# Altium project manta_flightcontroller.PrjPcb
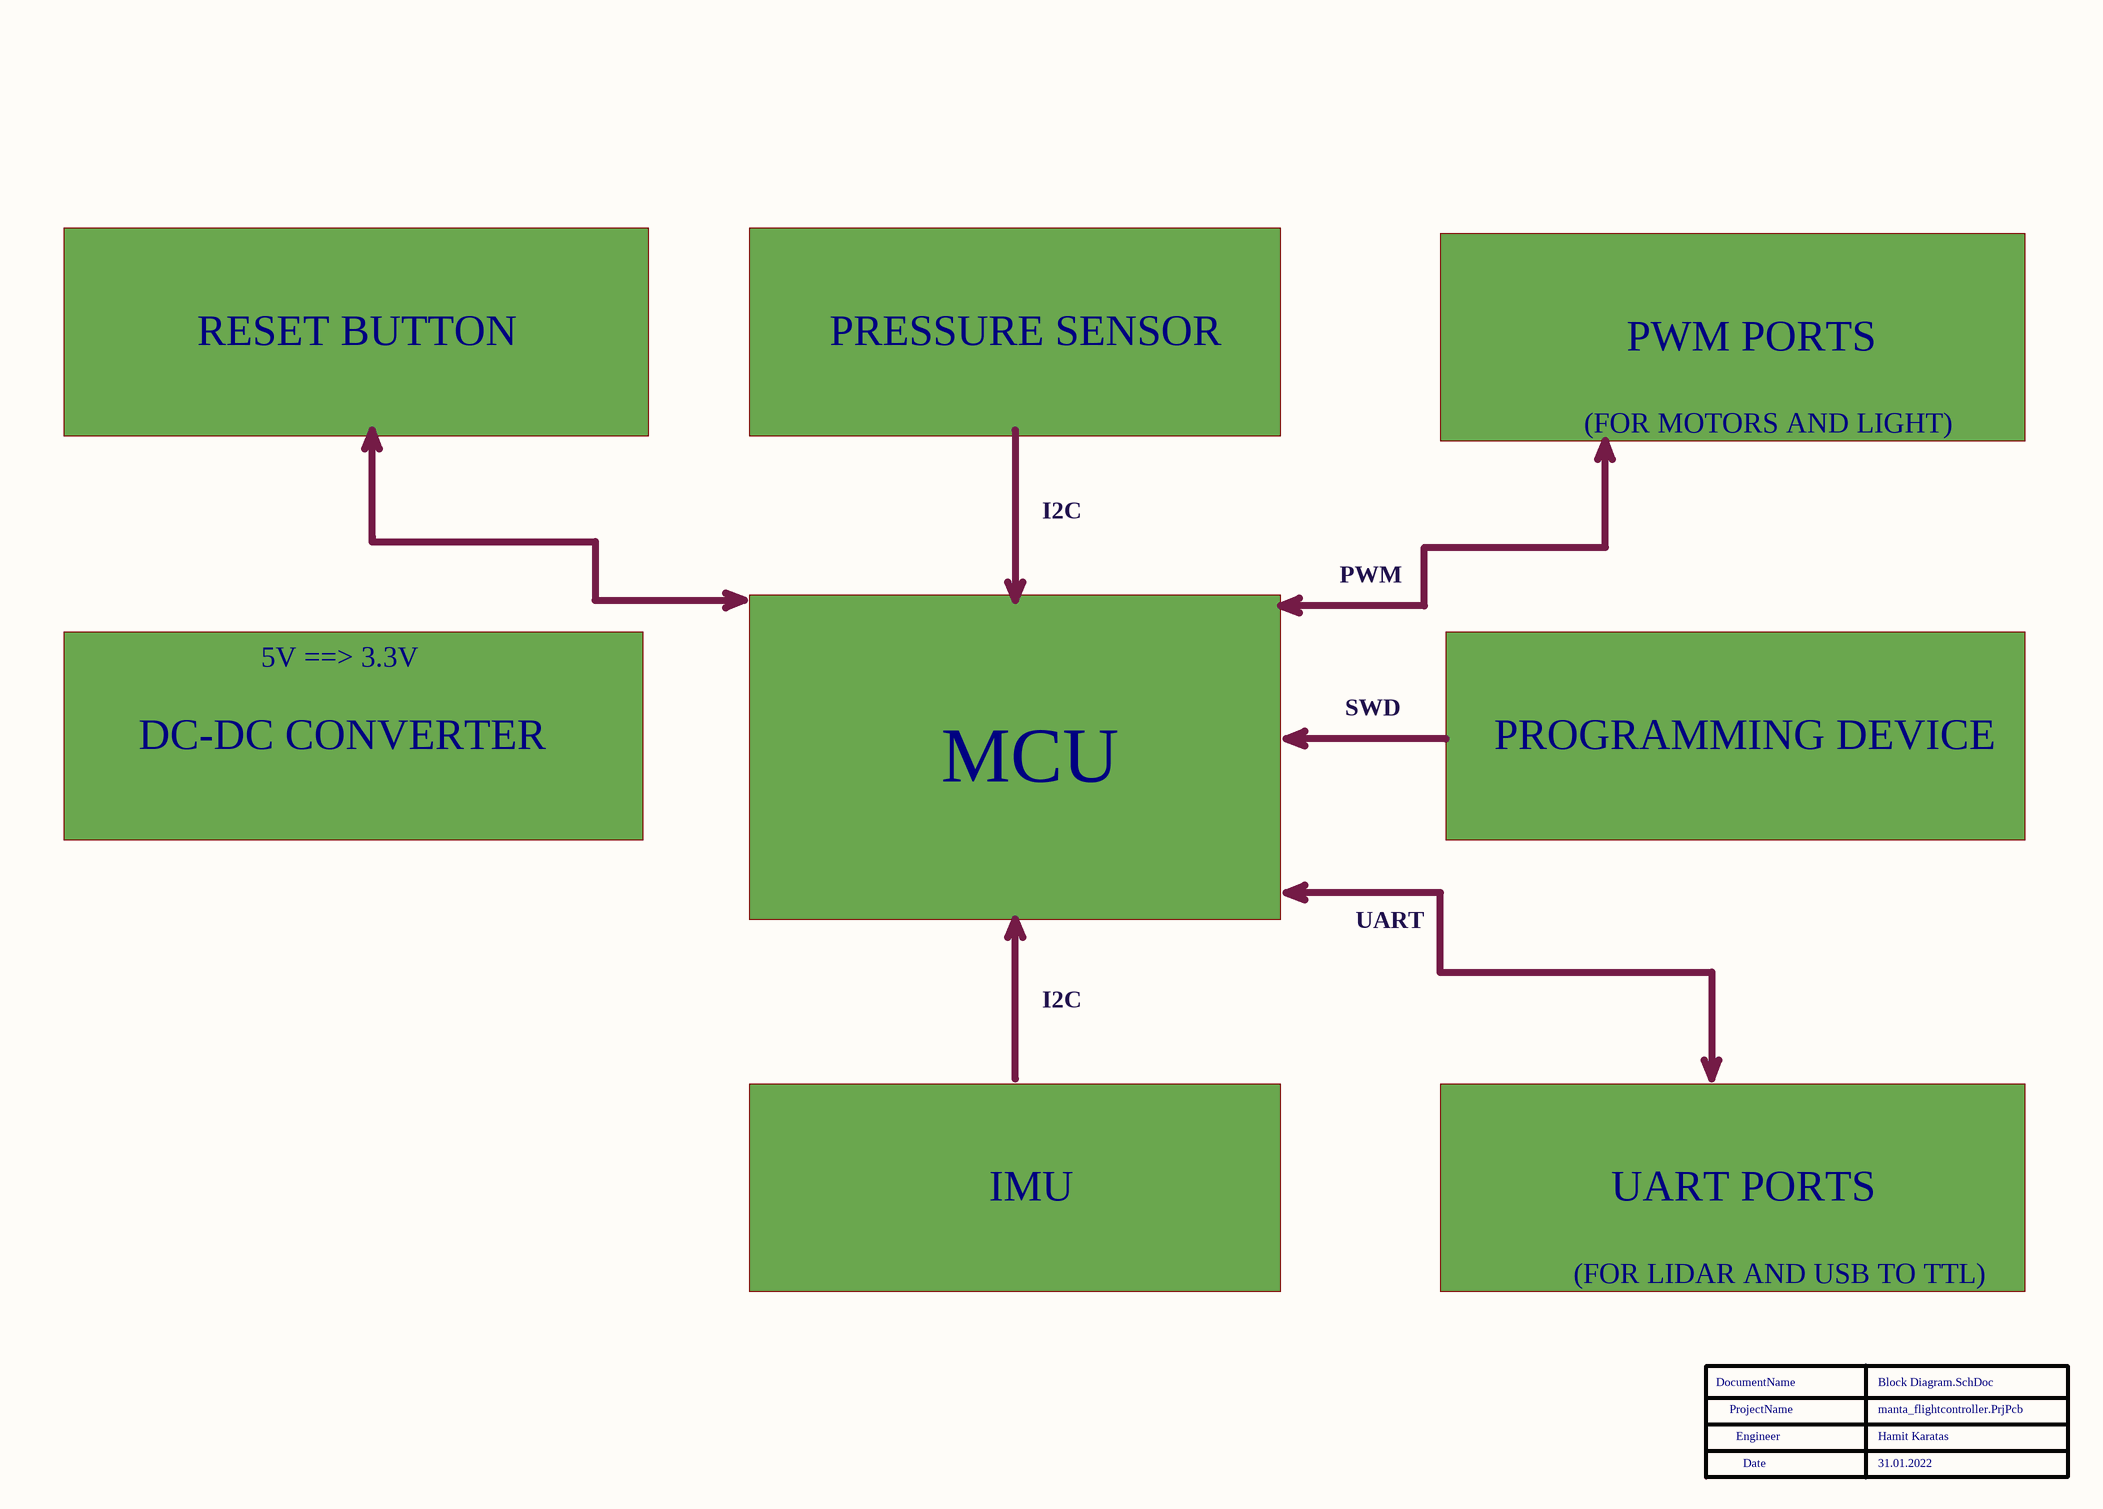
[diagram p0: Block Diagram.SchDoc]
2 sheets, 58 parts. Net scope: global (net labels, ports and power ports of the same name join across sheets).
Board file: PCB1.PcbDoc
Sheets:
  Block Diagram.SchDoc
  Sheet1.SchDoc

## Sheet Block Diagram.SchDoc
size A3; Engineer: Hamit Karatas; SheetNumber: 1; SheetTotal: 2

### Notes on the sheet
- RESET BUTTON
- PRESSURE SENSOR
- PWM PORTS
- (FOR MOTORS AND LIGHT)
- I2C
- PWM
- 5V ==> 3.3V
- SWD
- DC-DC CONVERTER
- PROGRAMMING DEVICE
- MCU
- UART
- IMU
- UART PORTS
- (FOR LIDAR AND USB TO TTL)
- DocumentName
- ProjectName
- Engineer
- Date
- 31.01.2022
- THIS DOCUMENT AND THE DATA DISCLOSED HEREIN OR
- HEREWITH IS THE PROPERTY OF ALTIUM LIMITED AND MAY
- DWG NO:
- REVISION
- REV:
- DESCRIPTION
- DATE
- APPROVED
- BE FREELY DISTRIBUTED IN WHOLE. NO RIGHTS ARE
- RESERVED OR EXPRESS OR IMPLIED WARANTEE GIVEN.
- ENG:
- APPROVALS
- PROJECT
- DSN:
- CHK:
- REFERENCE DOCUMENTS
- PROJECT REVISION:
- TITLE
- DOCUMENT REVISION:
- DESIGN ITEM:
- BOM:
- FAB DWG:
- PCB DWG:
- ASSY DWG:
- SCALE:
- A3
- SIZE
- CAGE CODE
- FILE NAME
- DWG NO.
- SHEET
- OF
- REV
- 31.01.2000

## Sheet Sheet1.SchDoc
size A3; Engineer: Hamit Karatas; SheetNumber: 2; SheetTotal: 2
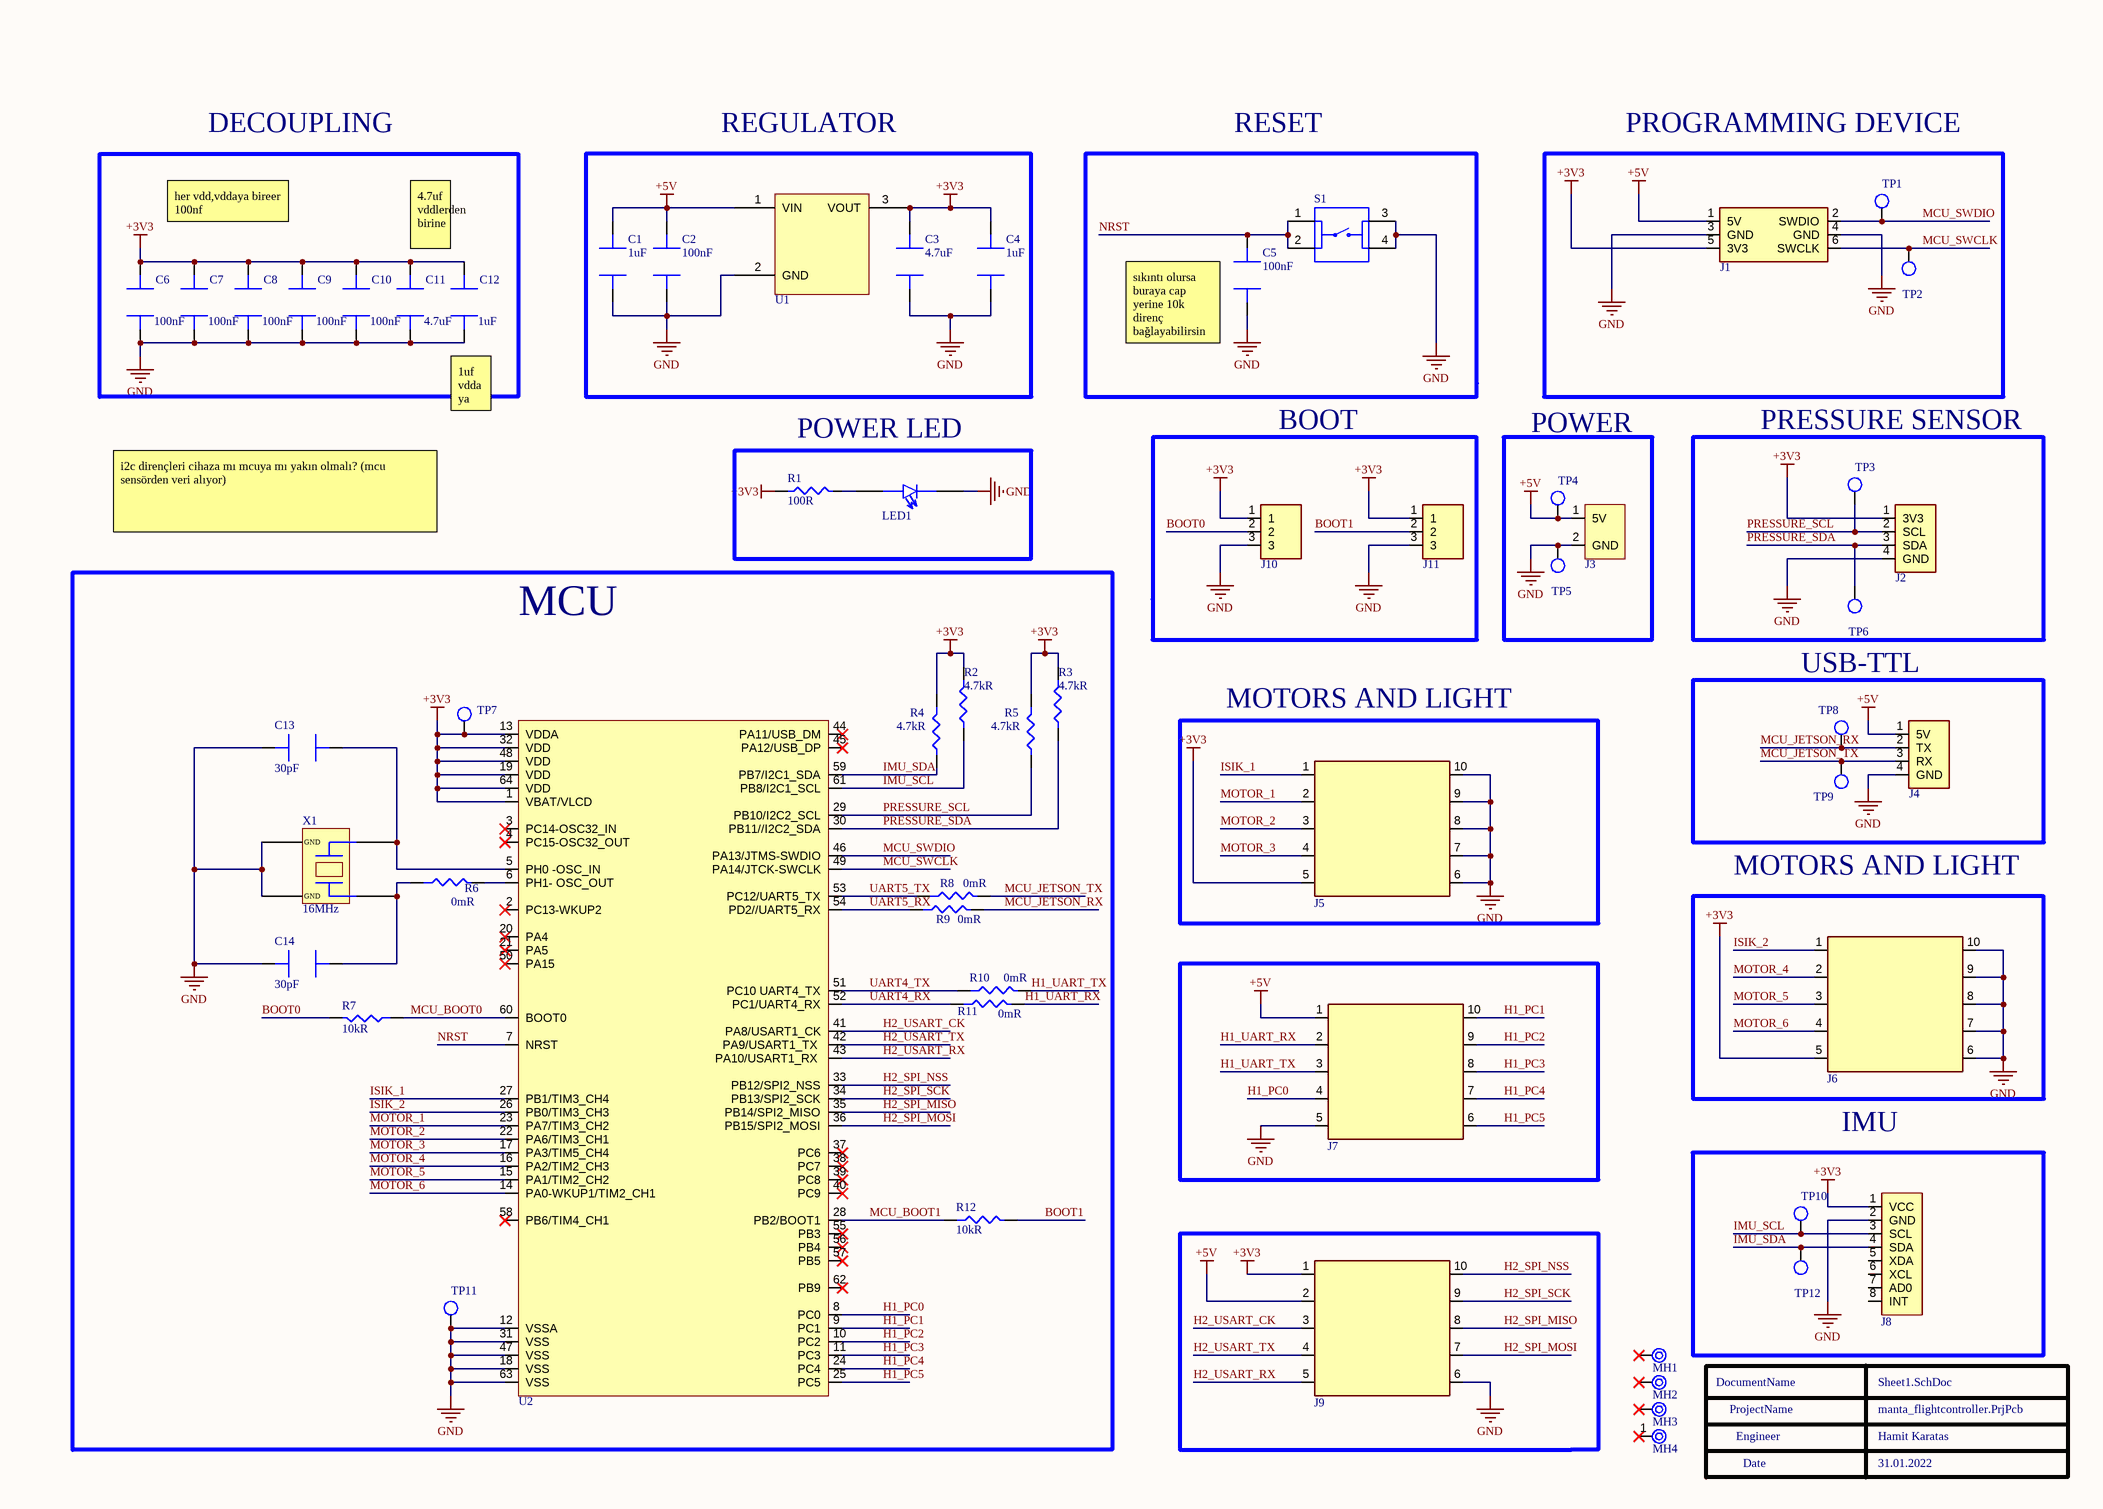
[diagram p1: Sheet1.SchDoc]

### Parts
C1  Capacitance: 1uF  [cap_0805]  (hidden comment: CAP CER 1uF 0805)
C2  Capacitance: 100nF  [cap_0805]  (hidden comment: CL21B104KBCNNNC)
C3  Capacitance: 4.7uF  [cap_0805]  (hidden comment: CL21A475KAQNNNE)
C4  Capacitance: 1uF  [cap_0805]  (hidden comment: CAP CER 1uF 0805)
C5  Capacitance: 100nF  [CAP_0603]  (hidden comment: CAP CER 100nF 0603)
C6  Capacitance: 100nF  [CAP_0603]  (hidden comment: CAP CER 100nF 0603)
C7  Capacitance: 100nF  [CAP_0603]  (hidden comment: CAP CER 100nF 0603)
C8  Capacitance: 100nF  [CAP_0603]  (hidden comment: CAP CER 100nF 0603)
C9  Capacitance: 100nF  [CAP_0603]  (hidden comment: CAP CER 100nF 0603)
C10  Capacitance: 100nF  [CAP_0603]  (hidden comment: CAP CER 100nF 0603)
C11  Capacitance: 4.7uF  [cap_0805]  (hidden comment: CL21A475KAQNNNE)
C12  Capacitance: 1uF  [cap_0805]  (hidden comment: CAP CER 1uF 0805)
C13  Capacitance: 30pF  [cap_0805]  (hidden comment: C0805C300M5HAC7800)
C14  Capacitance: 30pF  [cap_0805]  (hidden comment: C0805C300M5HAC7800)
J1  67997-206HLF  [CONN 6 PINS 2 ROWS]  (value not drawn)
J2  61300411121  [CONN 4PINS 1 ROW]  (value not drawn)
J3  TERMINAL BLOCK, PLUGGABLE, 5.08,  [TBP01R1-508-02BE]  (value not drawn)
J4  61300411121  [CONN 4PINS 1 ROW]  (value not drawn)
J5  302-S101  [CONN 10 PINS 2 ROWS]  (value not drawn)
J6  302-S101  [CONN 10 PINS 2 ROWS]  (value not drawn)
J7  302-S101  [CONN 10 PINS 2 ROWS]  (value not drawn)
J8  CONN 8 PIN  [CONN 8 PINS TH 2.54mm]  (value not drawn)
J9  302-S101  [CONN 10 PINS 2 ROWS]  (value not drawn)
J10  Conn Header HDR 3 POS 2.54mm  [CONN 3 PINS]  (value not drawn)
J11  Conn Header HDR 3 POS 2.54mm  [CONN 3 PINS]  (value not drawn)
LED1  LTST-C171GKT  [LED GREEN 0805]  (value not drawn)
MH1  MOUNTING HOLE  [MOUNTING HOLE]  (value not drawn)  (no BOM)
MH2  MOUNTING HOLE  [MOUNTING HOLE]  (value not drawn)  (no BOM)
MH3  MOUNTING HOLE  [MOUNTING HOLE]  (value not drawn)  (no BOM)
MH4  MOUNTING HOLE  [MOUNTING HOLE]  (value not drawn)  (no BOM)
R1  Resistance: 100R  [RES_0603]  (hidden comment: RC0603FR-7W100RL)
R2  Resistance: 4.7kR  [res_1206]  (hidden comment: RC0603JR-074K7L)
R3  Resistance: 4.7kR  [res_1206]  (hidden comment: RC0603JR-074K7L)
R4  Resistance: 4.7kR  [res_1206]  (hidden comment: RC0603JR-074K7L)
R5  Resistance: 4.7kR  [res_1206]  (hidden comment: RC0603JR-074K7L)
R6  Resistance: 0mR  [RES_0603]  (hidden comment: RC0603JR-070RL)
R7  Resistance: 10kR  [RES_0603]  (hidden comment: RES 10K OHM 0603)
R8  Resistance: 0mR  [RES_0603]  (hidden comment: RC0603JR-070RL)
R9  Resistance: 0mR  [RES_0603]  (hidden comment: RC0603JR-070RL)
R10  Resistance: 0mR  [RES_0603]  (hidden comment: RC0603JR-070RL)
R11  Resistance: 0mR  [RES_0603]  (hidden comment: RC0603JR-070RL)
R12  Resistance: 10kR  [RES_0603]  (hidden comment: RES 10K OHM 0603)
S1  1825910-6  [button]  (value not drawn)
TP1  TEST_POINT  [TEST POINT]  (value not drawn)  (no BOM)
TP2  TEST_POINT  [TEST POINT]  (value not drawn)  (no BOM)
TP3  TEST_POINT  [TEST POINT]  (value not drawn)  (no BOM)
TP4  TEST_POINT  [TEST POINT]  (value not drawn)  (no BOM)
TP5  TEST_POINT  [TEST POINT]  (value not drawn)  (no BOM)
TP6  TEST_POINT  [TEST POINT]  (value not drawn)  (no BOM)
TP7  TEST_POINT  [TEST POINT]  (value not drawn)  (no BOM)
TP8  TEST_POINT  [TEST POINT]  (value not drawn)  (no BOM)
TP9  TEST_POINT  [TEST POINT]  (value not drawn)  (no BOM)
TP10  TEST_POINT  [TEST POINT]  (value not drawn)  (no BOM)
TP11  TEST_POINT  [TEST POINT]  (value not drawn)  (no BOM)
TP12  TEST_POINT  [TEST POINT]  (value not drawn)  (no BOM)
U1  AP7361-33E-13  [AP7361-33E-13]  (value not drawn)
U2  STM32L152RET6  [STM32L152RET6]  (value not drawn)
X1  Frequency: 16MHz  [CRYSTAL_ECS-160-20-30B-TR]  (hidden comment: ECS-160-20-30B-TR)

### Blocks framed on the sheet
DECOUPLING: C6-C12
REGULATOR: C1-C4 U1
RESET: C5 S1
PROGRAMMING DEVICE: J1 TP1 TP2
POWER LED: LED1 R1
BOOT: J10 J11
POWER: J3 TP4 TP5
PRESSURE SENSOR: J2 TP3 TP6
MCU: C13 C14 R2-R12 TP7 TP11 U2 X1
USB-TTL: J4 TP8 TP9
MOTORS AND LIGHT: J5
MOTORS AND LIGHT: J6
IMU: J8 TP10 TP12

### Nets
+3V3: C3.2 C4.2 C6.2 C7.2 C8.2 C9.2 C10.2 C11.2 C12.2 J1.5(3V3) J2.1(3V3) J5.5 J6.5 J8.1(VCC) J9.1 J10.1 J11.1 R1.2 R2.0 R3.0 R4.0 R5.0 TP7.1(TP) U1.3(VOUT) U2.1(VBAT/VLCD) U2.13(VDDA) U2.19(VDD) U2.32(VDD) U2.48(VDD) U2.64(VDD)
+5V: C1.2 C2.2 J1.1(5V) J3.1(5V) J4.1(5V) J7.1 J9.2 TP4.1(TP) U1.1(VIN)
GND: C1.1 C2.1 C3.1 C4.1 C5.1 C6.1 C7.1 C8.1 C9.1 C10.1 C11.1 C12.1 C13.1 C14.1 J1.3(GND) J1.4(GND) J2.4(GND) J3.2(GND) J4.4(GND) J5.6 J5.7 J5.8 J5.9 J5.10 J6.6 J6.7 J6.8 J6.9 J6.10 J7.5 J8.2(GND) J9.6 J10.3 J11.3 LED1.C S1.3 S1.4 TP5.1(TP) TP11.1(TP) U1.2(GND) U2.12(VSSA) U2.18(VSS) U2.31(VSS) U2.47(VSS) U2.63(VSS) X1.2(GND) X1.4(GND)
BOOT0: J10.2 R7.2
BOOT1: J11.2 R12.2
H1_PC0: J7.4 U2.8(PC0)
H1_PC1: J7.10 U2.9(PC1)
H1_PC2: J7.9 U2.10(PC2)
H1_PC3: J7.8 U2.11(PC3)
H1_PC4: J7.7 U2.24(PC4)
H1_PC5: J7.6 U2.25(PC5)
H1_UART_RX: J7.2 R11.2
H1_UART_TX: J7.3 R10.2
H2_SPI_MISO: J9.8 U2.35(PB14/SPI2_MISO)
H2_SPI_MOSI: J9.7 U2.36(PB15/SPI2_MOSI)
H2_SPI_NSS: J9.10 U2.33(PB12/SPI2_NSS)
H2_SPI_SCK: J9.9 U2.34(PB13/SPI2_SCK)
H2_USART_CK: J9.3 U2.41(PA8/USART1_CK)
H2_USART_RX: J9.5 U2.43(PA10/USART1_RX)
H2_USART_TX: J9.4 U2.42(PA9/USART1_TX)
IMU_SCL: J8.3(SCL) R2.1 TP10.1(TP) U2.61(PB8/I2C1_SCL)
IMU_SDA: J8.4(SDA) R4.1 TP12.1(TP) U2.59(PB7/I2C1_SDA)
ISIK_1: J5.1 U2.27(PB1/TIM3_CH4)
ISIK_2: J6.1 U2.26(PB0/TIM3_CH3)
MCU_BOOT0: R7.1 U2.60(BOOT0)
MCU_BOOT1: R12.1 U2.28(PB2/BOOT1)
MCU_JETSON_RX: J4.2(TX) R9.2 TP8.1(TP)
MCU_JETSON_TX: J4.3(RX) R8.2 TP9.1(TP)
MCU_SWCLK: J1.6(SWCLK) TP2.1(TP) U2.49(PA14/JTCK-SWCLK)
MCU_SWDIO: J1.2(SWDIO) TP1.1(TP) U2.46(PA13/JTMS-SWDIO)
MOTOR_1: J5.2 U2.23(PA7/TIM3_CH2)
MOTOR_2: J5.3 U2.22(PA6/TIM3_CH1)
MOTOR_3: J5.4 U2.17(PA3/TIM5_CH4)
MOTOR_4: J6.2 U2.16(PA2/TIM2_CH3)
MOTOR_5: J6.3 U2.15(PA1/TIM2_CH2)
MOTOR_6: J6.4 U2.14(PA0-WKUP1/TIM2_CH1)
NRST: C5.2 S1.1 S1.2 U2.7(NRST)
PRESSURE_SCL: J2.2(SCL) R5.1 TP3.1(TP) U2.29(PB10/I2C2_SCL)
PRESSURE_SDA: J2.3(SDA) R3.1 TP6.1(TP) U2.30(PB11//I2C2_SDA)
UART4_RX: R11.1 U2.52(PC1/UART4_RX)
UART4_TX: R10.1 U2.51(PC10_UART4_TX)
UART5_RX: R9.1 U2.54(PD2//UART5_RX)
UART5_TX: R8.1 U2.53(PC12/UART5_TX)
NetC13_2: C13.2 U2.5(PH0_-OSC_IN) X1.3
NetC14_2: C14.2 R6.1 X1.1
NetLED1_A: LED1.A R1.1
NetR6_2: R6.2 U2.6(PH1-_OSC_OUT)

Not connected (* = marked no-connect by the designer): J8 5(XDA) 6(XCL) 7(AD0) 8(INT); MH1 1*; MH2 1*; MH3 1*; MH4 1*; U2 2(PC13-WKUP2)* 3(PC14-OSC32_IN)* 4(PC15-OSC32_OUT)* 20(PA4)* 21(PA5)* 37(PC6)* 38(PC7)* 39(PC8)* 40(PC9)* 44(PA11/USB_DM)* 45(PA12/USB_DP)* 50(PA15)* 55(PB3)* 56(PB4)* 57(PB5)* 58(PB6/TIM4_CH1)* 62(PB9)*

### Notes on the sheet
- her vdd,vddaya bireer 100nf
- 4.7uf vddlerden birine
- (near C5) permanent pull-up resistor bağlı buraya, eve ile direnç bağlamadım o yüzden
- (near C5) sıkıntı olursa buraya cap yerine 10k direnç bağlayabilirsin
- (near C12) 1uf vdda ya
- i2c dirençleri cihaza mı mcuya mı yakın olmalı? (mcu sensörden veri alıyor)
- power led (3.3-2.1)/30ma=40ohm
- (near X1) kristal devresi için kristal application guidea bak load capacitance 20pf 2*(20-cs) cs 3-8 arasında. cl=24-34 gmerit= 2* 50*(2*pi*16M)^2(7pf+20pf)^2 gm=3.5 gain=18
- DocumentName
- ProjectName
- Engineer
- Date
- 31.01.2022
- THIS DOCUMENT AND THE DATA DISCLOSED HEREIN OR
- HEREWITH IS THE PROPERTY OF ALTIUM LIMITED AND MAY
- DWG NO:
- REVISION
- REV:
- DESCRIPTION
- DATE
- APPROVED
- BE FREELY DISTRIBUTED IN WHOLE. NO RIGHTS ARE
- RESERVED OR EXPRESS OR IMPLIED WARANTEE GIVEN.
- ENG:
- APPROVALS
- PROJECT
- DSN:
- CHK:
- REFERENCE DOCUMENTS
- PROJECT REVISION:
- TITLE
- DOCUMENT REVISION:
- DESIGN ITEM:
- BOM:
- FAB DWG:
- PCB DWG:
- ASSY DWG:
- SCALE:
- A3
- SIZE
- CAGE CODE
- FILE NAME
- DWG NO.
- SHEET
- OF
- REV
- 31.01.2000

### Library data of the parts
C1 C4 C12 = CAP CER 1uF 0805: 0805 0.1 uF ±10 % Tolerance 50 V X7R Multilayer Ceramic Capacitors; Manufacturer: Samsung; Manufacturer Part Number: CL21B104KBFNNNE; Designed by: Hamit; Tolerance: 10%; Voltage Rating: 50V; Supplier 1: Digi-Key; RoHS: Yes; Category: Ceramic Capacitors; Pricing 1: 1=0,10000, 10=0,04900, 50=0,02700, 100=0,02200, 500=0,01574, 1000=0,01237 (USD); Mount: Surface Mount; Case/Package: 0805; Case Code (Metric): 2012; Case Code (Imperial): 0805; Contact Plating: Tin; Min Operating Temperature: -55°C; Max Operating Temperature: 125°C; Dielectric: X7R; Package Quantity: 1; Packaging: Tape and Reel; Voltage Rating (DC): 50V; Series: CL; Construction: Flat; Length: 2mm; Width: 0.049inch; Height: 1.25mm; Thickness: 0.053inch; Depth: 1.25mm; Radiation Hardening: No; Lead Free: Lead Free; RoHS Compliant: Yes; ComponentLink1URL: https://datasheet.ciiva.com/25736/cl21b104kbfnnne-25736721.pdf?src-supplier=Digi-Key; ComponentLink1Description: https://datasheet.ciiva.com/25736/cl21b104kbfnnne-25736721.pdf?src-supplier=Digi-Key; Supplier Part Number 1: 1276-1180-1-ND
C2 = CAP cer 100nF 0805: Samsung Electro-Mechanics 100nF Multilayer Ceramic Capacitor (MLCC) 50 V 10% X7R dielectric CL max op. temp. +125C; Designed by: Hamit; Voltage Rating: 50V; Supplier 1: Digi-Key; Manufacturer: Samsung; Manufacturer Part Number: CL21B104KBCNNNC; RoHS: Yes; Category: Ceramic Capacitors; Pricing 1: 1=0,10000, 10=0,05000, 50=0,02740, 100=0,02240, 500=0,01598, 1000=0,01256 (USD); Mount: Surface Mount; Case/Package: 0805; Case Code (Metric): 2012; Case Code (Imperial): 0805; Material: Ceramic; Contact Plating: Tin; Min Operating Temperature: -55°C; Max Operating Temperature: 125°C; Tolerance: 10%; Dielectric: X7R; Packaging: Tape and Reel; Voltage: 50V; Voltage Rating (DC): 50V; Series: CL; Construction: Flat; Length: 2mm; Width: 0.049inch; Height: 0.85mm; Depth: 1.25mm; Thickness: 0.037inch; Radiation Hardening: No; Lead Free: Lead Free; RoHS Compliant: Yes; ComponentLink1URL: https://datasheet.ciiva.com/25710/cl21b104kbcnnnc-25710182.pdf?src-supplier=Digi-Key; ComponentLink1Description: https://datasheet.ciiva.com/25710/cl21b104kbcnnnc-25710182.pdf?src-supplier=Digi-Key; ComponentLink2URL: https://datasheet.ciiva.com/29199/454152-da-01-en-vs-kondensator-0805-29199814.pdf?src-supplier=Conrad; ComponentLink2Description: https://datasheet.ciiva.com/29199/454152-da-01-en-vs-kondensator-0805-29199814.pdf?src-supplier=Conrad; Supplier Part Number 1: 1276-1003-1-ND
C3 = CAP_0805_4.7uF: SAMSUNG ELECTRO-MECHANICS - CL21A475KAQNNNE - SMD Multilayer Ceramic Capacitor, 4.7 µF, 25 V, 0805 [2012 Metric], ± 10%, X5R, CL Series; Voltage Rating: 25V; Designed by: Hamit; Supplier 1: Mouser; Manufacturer: Samsung; Manufacturer Part Number: CL21A475KAQNNNE; RoHS: Yes; Category: Ceramic Capacitors; Stock 1: 975; Pricing 1: 1=0,12000, 10=0,04800, 50=0,04800, 100=0,03900, 500=0,02800, 1000=0,02300, 2000=0,02000, 10000=0,02000 (USD); Mount: Surface Mount; Case/Package: 0805; Case Code (Metric): 2012; Case Code (Imperial): 0805; Min Operating Temperature: -55°C; Max Operating Temperature: 85°C; Package Quantity: 1; Packaging: Tape and Reel; Tolerance: 10%; Dielectric: X5R; Voltage Rating (DC): 25V; Series: CL; Construction: Flat; Length: 2mm; Width: 0.049inch; Height: 1.25mm; Thickness: 0.055inch; Depth: 1.25mm; Radiation Hardening: No; Lead Free: Lead Free; RoHS Compliant: Yes; ComponentLink1URL: https://datasheet.ciiva.com/25798/cl21a475kaqnnne-25798882.pdf?src-supplier=Digi-Key; ComponentLink1Description: https://datasheet.ciiva.com/25798/cl21a475kaqnnne-25798882.pdf?src-supplier=Digi-Key; Supplier Part Number 1: 187-CL21A475KAQNNNE
C5-C10 = CAP CER 100nF 0603: KEMET - C0603C104K5RACTU - SMD Multilayer Ceramic Capacitor, 0.1 µF, 50 V, 0603 [1608 Metric], ± 10%, X7R, C Series KEMET; Designed by: Hamit; Voltage Rating (DC): 50V; Dissipation Factor: 2.5%; Supplier 1: Digi-Key; Manufacturer: KEMET; Manufacturer Part Number: C0603C104K5RACTU; RoHS: Yes; Category: Ceramic Capacitors; Stock 1: 4486940; Pricing 1: 1=0,12000, 10=0,08900, 50=0,04840, 100=0,03940, 500=0,02818, 1000=0,02214 (USD); Mount: Surface Mount; Case/Package: 0603; Number of Pins: 2; Case Code (Metric): 1608; Case Code (Imperial): 0603; Dielectric Material: Ceramic; Contact Plating: Tin,Matte; Min Operating Temperature: -55°C; Max Operating Temperature: 125°C; Tolerance: 10%; Packaging: Tape and Reel; Package Quantity: 1; Dielectric: X7R; Termination: SMD/SMT; Voltage: 50V; Voltage Rating: 50V; Series: SMD Comm X7R; Length: 0.063inch; Width: 0.031inch; Height: 0.8mm; Thickness: 0.034inch; Lead Pitch: 0.7mm; Depth: 0.8mm; Radiation Hardening: No; RoHS Compliant: Yes; REACH SVHC: No SVHC; ComponentLink1URL: https://datasheet.ciiva.com/7823/kem-c1002-x7r-smd-7823591.pdf?src-supplier=Element14; ComponentLink1Description: https://datasheet.ciiva.com/7823/kem-c1002-x7r-smd-7823591.pdf?src-supplier=Element14; ComponentLink2URL: https://datasheet.ciiva.com/14602/70095383-14602583.pdf?src-supplier=Allied+Electronics; ComponentLink2Description: https://datasheet.ciiva.com/14602/70095383-14602583.pdf?src-supplier=Allied+Electronics; ComponentLink3URL: https://datasheet.ciiva.com/5999/kem-c1002-x7r-smd-5999400.pdf?src-supplier=Farnell; ComponentLink3Description: https://datasheet.ciiva.com/5999/kem-c1002-x7r-smd-5999400.pdf?src-supplier=Farnell; ComponentLink4URL: https://datasheet.ciiva.com/7823/kem-c1002-x7r-smd-7823592.pdf?src-supplier=Element14; ComponentLink4Description: https://datasheet.ciiva.com/7823/kem-c1002-x7r-smd-7823592.pdf?src-supplier=Element14; ComponentLink5URL: https://datasheet.ciiva.com/28645/1851736-28645640.pdf?src-supplier=Element14; ComponentLink5Description: https://datasheet.ciiva.com/28645/1851736-28645640.pdf?src-supplier=Element14; ComponentLink6URL: https://datasheet.ciiva.com/14585/70095383-14585209.pdf?src-supplier=Allied+Electronics; ComponentLink6Description: https://datasheet.ciiva.com/14585/70095383-14585209.pdf?src-supplier=Allied+Electronics; Supplier Part Number 1: 399-5089-6-ND
C11 = CAP CER 4.7 uF: SAMSUNG ELECTRO-MECHANICS - CL21A475KAQNNNE - SMD Multilayer Ceramic Capacitor, 4.7 µF, 25 V, 0805 [2012 Metric], ± 10%, X5R, CL Series; Voltage Rating: 25V; Designed by: Hamit; Supplier 1: Digi-Key; Manufacturer: Samsung; Manufacturer Part Number: CL21A475KAQNNNE; RoHS: Yes; Category: Ceramic Capacitors; Pricing 1: 1=0,12000, 10=0,08300, 50=0,04700, 100=0,03890, 500=0,02728, 1000=0,02259 (USD); Mount: Surface Mount; Case/Package: 0805; Case Code (Metric): 2012; Case Code (Imperial): 0805; Min Operating Temperature: -55°C; Max Operating Temperature: 85°C; Package Quantity: 1; Packaging: Tape and Reel; Tolerance: 10%; Dielectric: X5R; Voltage Rating (DC): 25V; Series: CL; Construction: Flat; Length: 2mm; Width: 0.049inch; Height: 1.25mm; Thickness: 0.055inch; Depth: 1.25mm; Radiation Hardening: No; Lead Free: Lead Free; RoHS Compliant: Yes; ComponentLink1URL: https://datasheet.ciiva.com/25798/cl21a475kaqnnne-25798882.pdf?src-supplier=Digi-Key; ComponentLink1Description: https://datasheet.ciiva.com/25798/cl21a475kaqnnne-25798882.pdf?src-supplier=Digi-Key; Supplier Part Number 1: 1276-1244-1-ND
C13 C14 = CAP CER 30 PF 0805: Cap Cer 0805 30PF 50V Ultra Stab; Manufacturer: KEMET; Supplier 1: Digi-Key; Manufacturer Part Number: C0805C300M5HAC7800; RoHS: No; Category: Ceramic Capacitors; Stock 1: 17957; Pricing 1: 1=0,10000, 10=0,07300, 50=0,03960, 100=0,03230, 500=0,02310, 1000=0,01815 (USD); Supplier Part Number 1: 399-C0805C300M5HAC7800CT-ND
J1 = CONN 6 PIN 2 ROWS: Conn Unshrouded Header HDR 6 POS 2.54mm Solder ST Top Entry Thru-Hole BergStik® Bulk; Manufacturer: ICC; Supplier 1: Newark; Manufacturer Part Number: 67997-206HLF; RoHS: No; Category: Headers and Wire Housings; Stock 1: 424; Pricing 1: 1=0,46900, 10=0,32500, 25=0,32100, 50=0,31700, 100=0,31300, 250=0,29200, 500=0,27200, 1000=0,23100, 2500=0,16100, 5000=0,15200, 10000=0,13400 (USD); Supplier Part Number 1: 33M7873
J2 J4 = CONN 4 PINS 1 ROW: CONN HEADER 4 POS 2.54; Manufacturer: Wurth Electronics; Number of Positions: 4; Gender: Male; Connector Type: Male Pin; Pitch: 0.1inch; Supplier 1: Digi-Key; Manufacturer Part Number: 61300411121; RoHS: Yes; Category: Headers and Wire Housings; Stock 1: 1627; Pricing 1: 1=0,19000, 10=0,15800, 25=0,13120, 50=0,11000, 100=0,09900, 1000=0,09100 (USD); Mount: Through Hole; Contact Plating: Gold; Contact Material: Copper; Color: Black; Number of Rows: 1; Packaging: Bulk; Termination: Solder; Number of Contacts: 4; Contact Mating Length: 0.236inch; REACH SVHC: Unknown; Lead Free: Lead Free; RoHS Compliant: Yes; ComponentLink1URL: http://www.farnell.com/cad/1737268.pdf?src-supplier=Element14; ComponentLink1Description: http://www.farnell.com/cad/1737268.pdf?src-supplier=Element14; ComponentLink2URL: https://katalog.we-online.de/em/datasheet/6130xx11121.pdf?src-supplier=Digi-Key; ComponentLink2Description: https://katalog.we-online.de/em/datasheet/6130xx11121.pdf?src-supplier=Digi-Key; Supplier Part Number 1: 732-5317-ND
J3 = TERMINAL BLOCK TBP01R1-508-02BE: Conn Shrouded Header HDR 2 POS 5.08mm Solder RA Side Entry Thru-Hole Bag; Manufacturer: CUI; Designed by: Hamit; Supplier 1: Digi-Key; Manufacturer Part Number: TBP01R1-508-02BE; RoHS: Yes; Stock 1: 4344; Pricing 1: 1=0,56000, 10=0,29600, 25=0,20960, 50=0,17840, 100=0,17220, 250=0,14560, 500=0,13464, 1000=0,11898, 5000=0,09080 (USD); Supplier Part Number 1: 102-6406-ND
J5-J7 J9 = CONN 10 PINS: 10 pin 接头，有罩 连接器 0.100&quot;（2.54mm） 通孔 金; Manufacturer: On-Shore Technology; Number of Positions: 10; Connector Type: Male Pin; Pitch: 0.1inch; Supplier 1: Digi-Key; Manufacturer Part Number: 302-S101; RoHS: Yes; Category: Connectors; Stock 1: 5852; Pricing 1: 1=0,29000, 10=0,24800, 100=0,19290, 500=0,16538, 1000=0,13781, 5000=0,11812, 10000=0,11025 (USD); Mount: Through Hole; Color: Black; Contact Plating: Gold; Number of Rows: 2; Packaging: Tray; Termination: Solder; Row Spacing: 0.1inch; ComponentLink1URL: https://datasheet.ciiva.com/732/302-sxxx-732946.pdf?src-supplier=Digi-Key; ComponentLink1Description: https://datasheet.ciiva.com/732/302-sxxx-732946.pdf?src-supplier=Digi-Key; Supplier Part Number 1: ED1543-ND
J10 J11 = CONN 3 PINS: Conn Unshrouded Header HDR 3 POS 2.54mm Solder ST Top Entry Thru-Hole BergStik® Bulk; Manufacturer: Amphenol ICC / FCI; Manufacturer Part Number: 68001-203HLF; Supplier 1: Digi-Key; RoHS: No; Category: Headers and Wire Housings; Stock 1: 4963; Pricing 1: 1=0,27000, 10=0,22600, 100=0,17360, 500=0,14692, 1000=0,12020, 5000=0,10685, 10000=0,09683 (USD); ComponentLink1URL: http://components.arrow.com/part/dataview/0323_00900381?src-supplier=Arrow+Europe; ComponentLink1Description: http://components.arrow.com/part/dataview/0323_00900381?src-supplier=Arrow+Europe; ComponentLink2URL: http://uk.rs-online.com/webdocs/1450/0900766b81450c64.pdf?src-supplier=RSComponents; ComponentLink2Description: http://uk.rs-online.com/webdocs/1450/0900766b81450c64.pdf?src-supplier=RSComponents; ComponentLink3URL: http://www.farnell.com/datasheets/1914865.pdf?src-supplier=Farnell; ComponentLink3Description: http://www.farnell.com/datasheets/1914865.pdf?src-supplier=Farnell; ComponentLink4URL: http://www.farnell.com/datasheets/1914865.pdf?src-supplier=Element14; ComponentLink4Description: http://www.farnell.com/datasheets/1914865.pdf?src-supplier=Element14; ComponentLink5URL: http://www.farnell.com/datasheets/1914865.pdf?src-supplier=Newark; ComponentLink5Description: http://www.farnell.com/datasheets/1914865.pdf?src-supplier=Newark; ComponentLink6URL: https://cdn.amphenol-icc.com/media/wysiwyg/files/drawing/68000.pdf?src-supplier=Digi-Key; ComponentLink6Description: https://cdn.amphenol-icc.com/media/wysiwyg/files/drawing/68000.pdf?src-supplier=Digi-Key; ComponentLink7URL: http://www.mouser.com/ds/2/154/68000-274373.pdf?src-supplier=Mouser; ComponentLink7Description: http://www.mouser.com/ds/2/154/68000-274373.pdf?src-supplier=Mouser; ComponentLink8URL: http://portal.fciconnect.com/Comergent/fci/drawing/68000.pdf?src-supplier=Avnet; ComponentLink8Description: http://portal.fciconnect.com/Comergent/fci/drawing/68000.pdf?src-supplier=Avnet; ComponentLink9URL: http://components.arrow.com/part/dataview/41914271S7424575N8314?src-supplier=Arrow+Electronics; ComponentLink9Description: http://components.arrow.com/part/dataview/41914271S7424575N8314?src-supplier=Arrow+Electronics; ComponentLink10URL: http://portal.fciconnect.com/Comergent/fci/drawing/68000.pdf?src-supplier=Avnet+Europe; ComponentLink10Description: http://portal.fciconnect.com/Comergent/fci/drawing/68000.pdf?src-supplier=Avnet+Europe; ComponentLink11URL: https://www.alliedelec.com/m/d/5c9a93367e9d0f191689c8d93ba26bad.pdf?src-supplier=Allied+Electronics; ComponentLink11Description: https://www.alliedelec.com/m/d/5c9a93367e9d0f191689c8d93ba26bad.pdf?src-supplier=Allied+Electronics; Supplier Part Number 1: 609-3470-ND
LED1 = LED GREEN 0805: Green 0805 130 º Min 5 mcd Typical 12 mcd Water Clear Lens SMT LED; Manufacturer: Vishay Lite-On; Designed by: Hamit; Lens Color: Colorless; Viewing Angle: 130°; Lens Style: Diffused,Colorless,Rectangular,Clear; Luminous Intensity: 12mcd; Forward Current: 30mA; Forward Voltage: 2.1V; Power Rating: 100mW; Dominant Wavelength: 569nm; Test Current: 10mA; Number of Elements: 1; Wavelength: 585nm; Reverse Voltage: 5V; Supplier 1: Digi-Key; Manufacturer Part Number: LTST-C171GKT; RoHS: Yes; Category: LEDs; Pricing 1: 6000=0,00000 (USD); Mount: Surface Mount; Case/Package: 0805; Number of Pins: 2; Color: Green; Case Code (Metric): 2012; Case Code (Imperial): 0805; Min Operating Temperature: -55°C; Max Operating Temperature: 85°C; Package Quantity: 1; Packaging: Tape and Reel; Illumination Color: Green; Lens Transparency: Clear; Power Dissipation: 100mW; Number of LEDs: 1; Series: CHIPLED 0805; Length: 2mm; Width: 1.25mm; Height: 0.8mm; Depth: 1.25mm; Radiation Hardening: No; Lead Free: Lead Free; RoHS Compliant: Yes; ComponentLink1URL: https://datasheet.ciiva.com/2110/ltst-c171gkt-2110000.pdf?src-supplier=Digi-Key; ComponentLink1Description: https://datasheet.ciiva.com/2110/ltst-c171gkt-2110000.pdf?src-supplier=Digi-Key; ComponentLink2URL: https://datasheet.ciiva.com/11773/0900766b80dc0296-11773991.pdf?src-supplier=RSComponents; ComponentLink2Description: https://datasheet.ciiva.com/11773/0900766b80dc0296-11773991.pdf?src-supplier=RSComponents; ComponentLink3URL: https://datasheet.ciiva.com/12400/lite-on-ltst-c171gkt-190133-12400647.pdf?src-supplier=Mouser; ComponentLink3Description: https://datasheet.ciiva.com/12400/lite-on-ltst-c171gkt-190133-12400647.pdf?src-supplier=Mouser; ComponentLink4URL: https://datasheet.ciiva.com/2110/ltst-c171gkt-2110001.pdf?src-supplier=Digi-Key; ComponentLink4Description: https://datasheet.ciiva.com/2110/ltst-c171gkt-2110001.pdf?src-supplier=Digi-Key; ComponentLink5URL: https://datasheet.ciiva.com/2110/ltst-c171gkt-2110002.pdf?src-supplier=Digi-Key; ComponentLink5Description: https://datasheet.ciiva.com/2110/ltst-c171gkt-2110002.pdf?src-supplier=Digi-Key; ComponentLink6URL: https://datasheet.ciiva.com/16396/ltst-c171gkt-16396549.pdf?src-supplier=Future+Electronics; ComponentLink6Description: https://datasheet.ciiva.com/16396/ltst-c171gkt-16396549.pdf?src-supplier=Future+Electronics; Supplier Part Number 1: 160-1423-2-ND
R1 = RES 100 OHM 0603: RESISTOR, 0603, 100R, 1%; Manufacturer: Yageo; Voltage Rating: 50V; Power Rating: 100mW; Temperature Coefficient: 100ppm/°C; Supplier 1: Digi-Key; Manufacturer Part Number: RC0603FR-7W100RL; RoHS: Yes; Category: Chip SMD Resistors; Stock 1: 23140; Pricing 1: 1=0,10000, 10=0,03600, 100=0,01450, 1000=0,00652, 2500=0,00566 (USD); Case/Package: 0603; Number of Pins: 2; Case Code (Metric): 1608; Case Code (Imperial): 0603; Packaging: Cut Tape; Tolerance: 1%; Resistor Type: Thick Film; Voltage Rating (DC): 50V; Resistance Tolerance: 1%; Series: RC0603; REACH SVHC: Unknown; RoHS Compliant: Yes; ComponentLink1URL: https://datasheet.ciiva.com/22704/1675737-22704044.pdf?src-supplier=Element14; ComponentLink1Description: https://datasheet.ciiva.com/22704/1675737-22704044.pdf?src-supplier=Element14; ComponentLink2URL: https://datasheet.ciiva.com/7746/1675737-7746414.pdf?src-supplier=Element14; ComponentLink2Description: https://datasheet.ciiva.com/7746/1675737-7746414.pdf?src-supplier=Element14; Supplier Part Number 1: 13-RC0603FR-7W100RLCT-ND
R2-R5 = RES 4K7 OHM: Res Thick Film 0603 4.7K Ohm 5% 0.1W(1/10W) ±100ppm/C Molded SMD Paper T/R; Manufacturer: Yageo; Designed by: Hamit; Temperature Coefficient: 100ppm/°C; Voltage Rating (DC): 50V; Power Rating: 100mW; Supplier 1: Digi-Key; Manufacturer Part Number: RC0603JR-074K7L; RoHS: Yes; Category: Chip SMD Resistors; Stock 1: 321494; Pricing 1: 1=0,10000, 10=0,02000, 100=0,00800, 1000=0,00360, 2500=0,00312 (USD); Case/Package: 0603; Number of Pins: 2; Case Code (Imperial): 0603; Case Code (Metric): 1608; Size Code: 0603; Min Operating Temperature: -55°C; Max Operating Temperature: 155°C; Resistor Type: Thick Film; Tolerance: 5%; Packaging: Tape and Reel; Voltage Rating: 50V; Termination: SMD/SMT; Features: Moisture Resistant; Max Power Dissipation: 100mW; Number of Terminations: 2; Series: RC; Resistance Tolerance: 5%; Construction: Rectangular; Length: 1.6mm; Width: 0.8mm; Depth: 0.8mm; REACH SVHC: No SVHC; Lead Free: Lead Free; RoHS Compliant: Yes; Military Standard: Not; ComponentLink1URL: https://datasheet.ciiva.com/46412/443971-46412858.pdf?src-supplier=Element14; ComponentLink1Description: https://datasheet.ciiva.com/46412/443971-46412858.pdf?src-supplier=Element14; Supplier Part Number 1: 311-4.7KGRCT-ND
R6 R8-R11 = RES 0 ohm 0603: RES SMD 0 OHM JUMPER 1/10W 0603; Manufacturer: Yageo; Designed by: Hamit; Tolerance: 1%; Power Rating: 100mW; Voltage Rating (DC): 50V; Temperature Coefficient: 200ppm/°C; Resistance Tolerance: 5%; Supplier 1: Digi-Key; Manufacturer Part Number: RC0603JR-070RL; RoHS: Yes; Category: Chip SMD Resistors; Stock 1: 6474034; Pricing 1: 1=0,10000, 10=0,01700, 25=0,01240, 50=0,00940, 100=0,00700, 250=0,00532, 500=0,00424, 1000=0,00313 (USD); Case/Package: 0603; Number of Pins: 2; Contact Plating: Tin,Matte; Case Code (Imperial): 0603; Case Code (Metric): 1608; Size Code: 0603; Min Operating Temperature: -55°C; Max Operating Temperature: 155°C; Resistor Type: Thick Film; Packaging: Tape and Reel; Termination: SMD/SMT; Series: RC; Technology: THICK FILM; Package Quantity: 5000; Voltage Rating: 50V; Features: Moisture Resistant; Max Power Dissipation: 100mW; Number of Terminations: 2; Construction: Rectangular; Length: 1.6mm; Width: 0.8mm; Height: 0.45mm; Depth: 0.8mm; Radiation Hardening: No; REACH SVHC: No SVHC; Lead Free: Lead Free; RoHS Compliant: Yes; Military Standard: Not; Supplier Part Number 1: 311-0.0GRDKR-ND
R7 R12 = RES 10K OHM 0603: Res General Purpose Thick Film 0603 10K Ohm 1% 1/10W ±100ppm/°C Molded SMD Paper T/R; Manufacturer: Yageo; Manufacturer Part Number: RC0603FR-0710KL; Voltage Rating (DC): 50V; Power Rating: 100mW; Voltage Rating: 75V; Designed by: Hamit; Supplier 1: Digi-Key; RoHS: Yes; Category: Chip SMD Resistors; Stock 1: 28304153; Pricing 1: 1=0,10000, 10=0,02400, 100=0,00970, 1000=0,00436, 2500=0,00378 (USD); Case/Package: 0603; Number of Pins: 2; Case Code (Imperial): 0603; Case Code (Metric): 1608; Weight: 7.1E-05oz; Size Code: 0603; Min Operating Temperature: -55°C; Max Operating Temperature: 155°C; Tolerance: 1%; Resistor Type: Thick Film; Temperature Coefficient: 100ppm/°C; Packaging: Tape and Reel; Termination: SMD/SMT; Features: Moisture Resistant; Series: RC; Max Power Dissipation: 100mW; Number of Terminations: 2; Resistance Tolerance: 1%; Construction: Rectangular; Length: 1.6mm; Width: 0.8mm; Height: 0.45mm; Depth: 0.8mm; Lead Pitch: 0.3mm; REACH SVHC: Unknown; Lead Free: Lead Free; Military Standard: Not; RoHS Compliant: Yes; ComponentLink1URL: https://datasheet.ciiva.com/7660/38590-7660789.pdf?src-supplier=Element14; ComponentLink1Description: https://datasheet.ciiva.com/7660/38590-7660789.pdf?src-supplier=Element14; ComponentLink2URL: https://datasheet.ciiva.com/7983/443971-7983596.pdf?src-supplier=Element14; ComponentLink2Description: https://datasheet.ciiva.com/7983/443971-7983596.pdf?src-supplier=Element14; ComponentLink3URL: https://datasheet.ciiva.com/22747/443971-22747519.pdf?src-supplier=Element14; ComponentLink3Description: https://datasheet.ciiva.com/22747/443971-22747519.pdf?src-supplier=Element14; ComponentLink4URL: https://datasheet.ciiva.com/46440/1868787-46440891.pdf?src-supplier=Element14; ComponentLink4Description: https://datasheet.ciiva.com/46440/1868787-46440891.pdf?src-supplier=Element14; ComponentLink5URL: https://datasheet.ciiva.com/7746/1738695-7746239.pdf?src-supplier=Element14; ComponentLink5Description: https://datasheet.ciiva.com/7746/1738695-7746239.pdf?src-supplier=Element14; ComponentLink6URL: https://datasheet.ciiva.com/15189/getdatasheetpartid-409289-15189591.pdf?src-supplier=Verical; ComponentLink6Description: https://datasheet.ciiva.com/15189/getdatasheetpartid-409289-15189591.pdf?src-supplier=Verical; Supplier Part Number 1: 311-10.0KHRCT-ND
S1 = button 4 pads: Switch Tactile OFF (ON) SPST Round Button PC Pins 0.05A 24VDC 1.57N Thru-Hole Loose; Manufacturer: TE Connectivity Alcoswitch; Mechanical Life: 100000Cycles; Actuator Material: PBT; Actuator Color: Black; Operating Force: 160gf; Illumination Type: Non-Illuminated,Illuminated; Switch Travel: 0.25mm; Switch Function: Off-Mom; Max Voltage Rating (DC): 24V; Contact Current Rating: 50mA; Actuator Type: Standard; Contact Resistance: 100mR; Actuator Length: 0.055inch; Supplier 1: Digi-Key; Manufacturer Part Number: 1825910-6; RoHS: Yes; Category: Pushbutton Switches; Stock 1: 136328; Pricing 1: 1=0,12000, 10=0,11300, 25=0,10720, 100=0,09750, 250=0,09164, 500=0,08382, 1000=0,07018, 2500=0,06823, 5000=0,06433 (USD); Mount: Through Hole; Contact Material: Copper Alloy; Contact Plating: Silver; Min Operating Temperature: -35°C; Max Operating Temperature: 85°C; Termination: PC Pins; Throw Configuration: SPST; Package Quantity: 750; Packaging: Loose Piece; Orientation: Straight; Series: FSMJ; Electrical Life: 100000Cycles; Type: Switch; Max Current Rating: 50mA; Length: 5.99mm; RoHS Compliant: Yes; REACH SVHC: Unknown; ELV: Compliant; Lead Free: Lead Free; ComponentLink1URL: https://datasheet.ciiva.com/30199/1825910-6rqpn1825910-6-30199520.pdf?src-supplier=Onlinecomponents.com; ComponentLink1Description: https://datasheet.ciiva.com/30199/1825910-6rqpn1825910-6-30199520.pdf?src-supplier=Onlinecomponents.com; ComponentLink2URL: https://datasheet.ciiva.com/15184/getdatasheetpartid-395915-15184509.pdf?src-supplier=Verical; ComponentLink2Description: https://datasheet.ciiva.com/15184/getdatasheetpartid-395915-15184509.pdf?src-supplier=Verical; Supplier Part Number 1: 450-1650-ND
TP1-TP12 = TEST POINT
U1 = REGULATOR AP7361-33E-13: LDO Regulator Pos 3.3V 1A 4-Pin(3+Tab) SOT-223 T/R; Manufacturer: Diodes; Designed by: Hamit; Number of Outputs: 1; Min Input Voltage: 2.2V; Max Input Voltage: 6V; Max Power Dissipation: 1.1W; Dropout Voltage: 500mV; Min Current Limit: 1.1A; Polarity: Positive; Quiescent Current: 70uA; Power Dissipation: 1.1kW; Accuracy: 1%; Power Supply Rejection Ratio (PSRR): 65dB; Reference Voltage: 800mV; Output Type: Fixed; Supplier 1: Digi-Key; Manufacturer Part Number: AP7361-33E-13; RoHS: Yes; Category: Voltage Regulators - Linear; Pricing 1: 1=0,51000, 10=0,41400, 25=0,37840, 100=0,28150, 250=0,25516, 500=0,21116, 1000=0,15836 (USD); Mount: Surface Mount; Case/Package: SOT-223; Number of Pins: 4; Weight: 0.000282oz; Contact Plating: Tin,Matte; Min Operating Temperature: -40°C; Max Operating Temperature: 85°C; Max Output Current: 1A; Output Voltage: 3.3V; Package Quantity: 1; Packaging: Tape and Reel; Output Current: 1A; Number of Regulators: 1; Series: -; Radiation Hardening: No; REACH SVHC: No SVHC; Lead Free: Lead Free; RoHS Compliant: Yes; ComponentLink1URL: https://datasheet.ciiva.com/26926/getdatasheetpartid-670786-26926141.pdf?src-supplier=Verical; ComponentLink1Description: https://datasheet.ciiva.com/26926/getdatasheetpartid-670786-26926141.pdf?src-supplier=Verical; ComponentLink2URL: https://datasheet.ciiva.com/25651/ap7361-25651049.pdf?src-supplier=Digi-Key; ComponentLink2Description: https://datasheet.ciiva.com/25651/ap7361-25651049.pdf?src-supplier=Digi-Key; ComponentLink3URL: https://datasheet.ciiva.com/29568/ap7361-29568378.pdf?src-supplier=Digi-Key; ComponentLink3Description: https://datasheet.ciiva.com/29568/ap7361-29568378.pdf?src-supplier=Digi-Key; ComponentLink4URL: https://datasheet.ciiva.com/29568/ap7361-29568379.pdf?src-supplier=Digi-Key; ComponentLink4Description: https://datasheet.ciiva.com/29568/ap7361-29568379.pdf?src-supplier=Digi-Key; Supplier Part Number 1: AP7361-33E-13DICT-ND
U2 = STM32L152RET6: Ultra-low-power ARM Cortex-M3 MCU with 512 Kbytes Flash, 32 MHz CPU, USB, 2xOp-amp; Manufacturer: STMicroelectronics; Interface: I2C,SPI,USB,IrDA,UART,USART,LIN,I2S; Data Bus Width: 32b; RAM Size: 80KB; Max Power Dissipation: 435mW; Number of I/Os: 51; Number of Timers/Counters: 9; Frequency: 32MHz; Oscillator Type: Internal; Min Supply Voltage: 1.8V; Max Supply Voltage: 3.6V; Watchdog Timer: Yes; Memory Size: 512KB; Number of ADC Channels: 21; Peripherals: Brown-out Detect/Reset,POR,PWM,WDT,DMA,LCD; Supplier 1: RSComponents; Manufacturer Part Number: STM32L152RET6; RoHS: Yes; Category: Microcontrollers; Stock 1: 10; Pricing 1: 160=6,32900 (GBP); Case/Package: LQFP; Number of Pins: 64; Weight: 0.012088oz; Min Operating Temperature: -40°C; Max Operating Temperature: 85°C; Packaging: Tray; Core Architecture: ARM; Package Quantity: 160; Number of Programmable I/O: 51; Max Frequency: 32MHz; Memory Type: FLASH; REACH SVHC: No SVHC; RoHS Compliant: Yes; ComponentLink1URL: https://datasheet.ciiva.com/48492/dm00098321-48492415.pdf?src-supplier=Avnet; ComponentLink1Description: https://datasheet.ciiva.com/48492/dm00098321-48492415.pdf?src-supplier=Avnet; Supplier Part Number 1: 1962078
X1 = CRYSTAL 16MHZ 20PF SMD: CRYSTAL 16.0000MHZ 20PF SMD; Manufacturer: ECS International; Designed by: Hamit; Frequency Tolerance: 30ppm; ESR (Equivalent Series Resistance): 50R; Frequency Stability: 50ppm; Supplier 1: Digi-Key; Manufacturer Part Number: ECS-160-20-30B-TR; RoHS: Yes; Category: Crystals; Stock 1: 5789; Pricing 1: 1=1,33000, 10=1,26800, 50=1,23900, 100=1,06200, 500=1,03250 (USD); Mount: Surface Mount; Case/Package: SMD/SMT; Min Operating Temperature: -20°C; Max Operating Temperature: 70°C; Package Quantity: 1; Load Capacitance: 20pF; Packaging: Tape and Reel; Tolerance: 50ppm; Termination: SMD/SMT; Series: ECX-53B; Length: 0.197inch; Width: 0.126inch; Height: 0.033inch; Lead Free: Lead Free; RoHS Compliant: Yes; ComponentLink1URL: https://datasheet.ciiva.com/853/ecx-53b-853408.pdf?src-supplier=Digi-Key; ComponentLink1Description: https://datasheet.ciiva.com/853/ecx-53b-853408.pdf?src-supplier=Digi-Key; ComponentLink2URL: https://datasheet.ciiva.com/853/ecx-53b-853406.pdf?src-supplier=Digi-Key; ComponentLink2Description: https://datasheet.ciiva.com/853/ecx-53b-853406.pdf?src-supplier=Digi-Key; ComponentLink3URL: https://datasheet.ciiva.com/853/ecx-53b-853407.pdf?src-supplier=Digi-Key; ComponentLink3Description: https://datasheet.ciiva.com/853/ecx-53b-853407.pdf?src-supplier=Digi-Key; Supplier Part Number 1: XC1120CT-ND